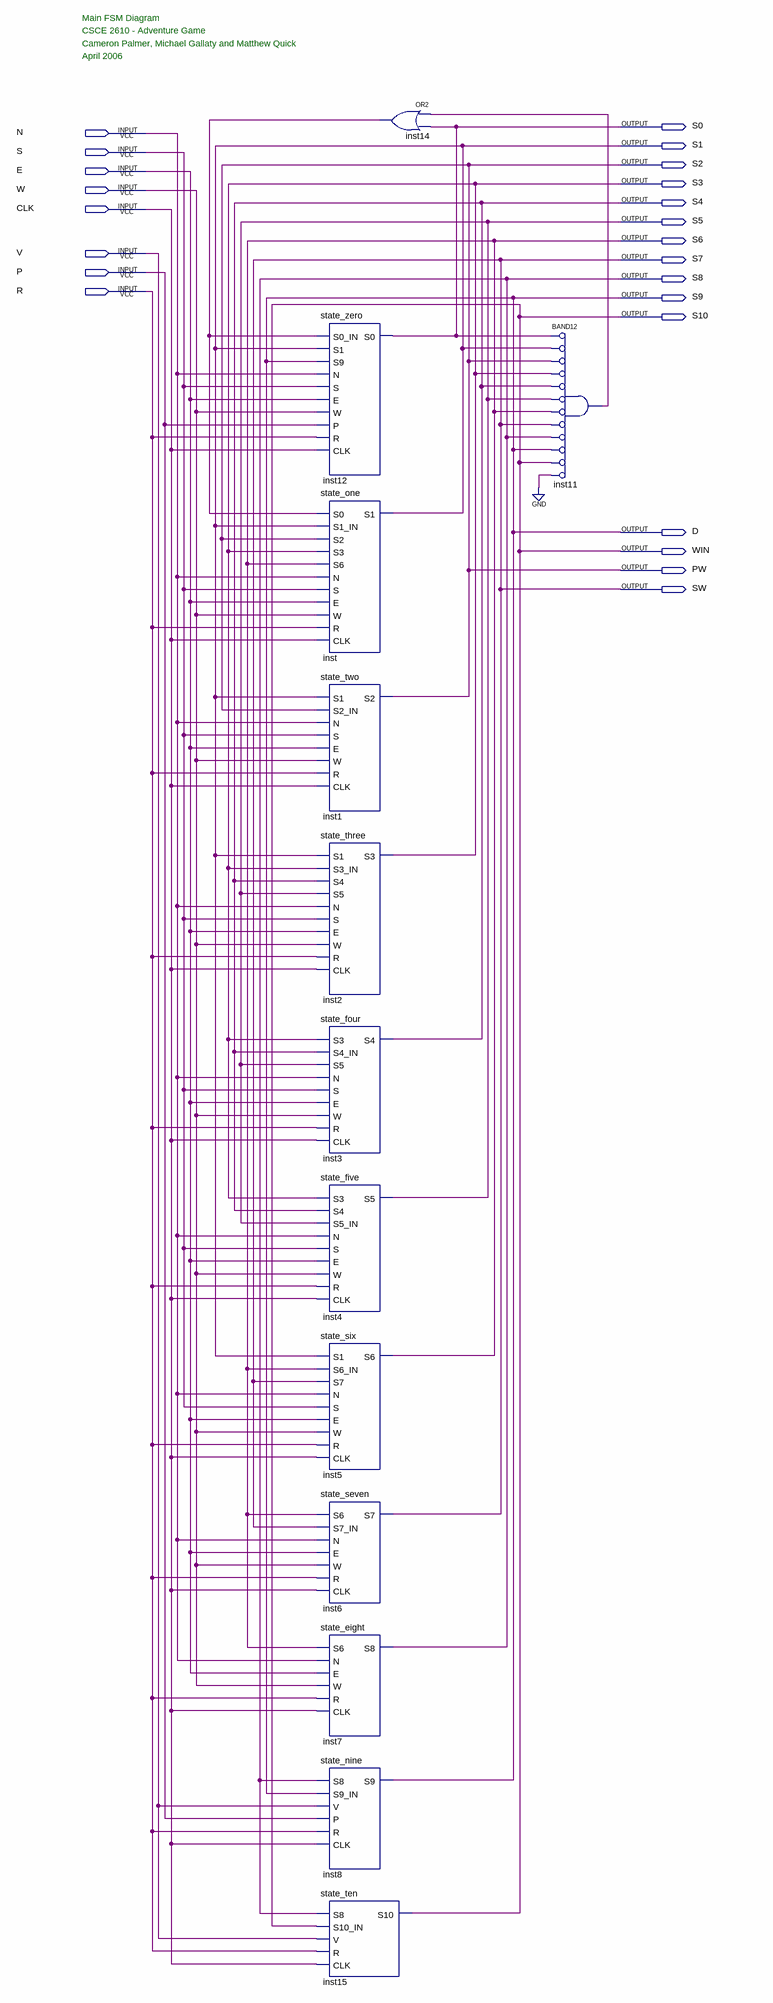
[diagram p0: schematic sheet]
// Quartus schematic main_fsm.bdf as structural Verilog: 13 symbols, 23 pins
module main_fsm (
  input  N,
  input  S,
  input  E,
  input  W,
  input  CLK,
  input  V,
  input  P,
  input  R,
  output S0,
  output S1,
  output S2,
  output S3,
  output S4,
  output S5,
  output S6,
  output S7,
  output S8,
  output S9,
  output S10,
  output D,
  output WIN,
  output PW,
  output SW
);

  wire inst11_out, inst14_out;

  state_zero inst12 (.S0_IN(inst14_out), .S1(S1), .S9(D), .N(N), .S(S), .E(E), .W(W), .P(P), .R(R), .CLK(CLK), .S0(S0));
  state_one inst (
    .S0(inst14_out), .S1_IN(S1), .S2(PW), .S3(S3), .S6(S6), .N(N), .S(S), .E(E), .W(W), .R(R), .CLK(CLK),
    .S1(S1));
  state_two inst1 (.S1(S1), .S2_IN(PW), .N(N), .S(S), .E(E), .W(W), .R(R), .CLK(CLK), .S2(PW));
  state_three inst2 (.S1(S1), .S3_IN(S3), .S4(S4), .S5(S5), .N(N), .S(S), .E(E), .W(W), .R(R), .CLK(CLK), .S3(S3));
  state_four inst3 (.S3(S3), .S4_IN(S4), .S5(S5), .N(N), .S(S), .E(E), .W(W), .R(R), .CLK(CLK), .S4(S4));
  state_five inst4 (.S3(S3), .S4(S4), .S5_IN(S5), .N(N), .S(S), .E(E), .W(W), .R(R), .CLK(CLK), .S5(S5));
  state_six inst5 (.S1(S1), .S6_IN(S6), .S7(S7), .N(N), .S(S), .E(E), .W(W), .R(R), .CLK(CLK), .S6(S6));
  state_seven inst6 (.S6(S6), .S7_IN(S7), .N(N), .E(E), .W(W), .R(R), .CLK(CLK), .S7(S7));
  state_eight inst7 (.S6(S6), .N(N), .E(E), .W(W), .R(R), .CLK(CLK), .S8(S8));
  state_nine inst8 (.S8(S8), .S9_IN(D), .V(V), .P(P), .R(R), .CLK(CLK), .S9(D));
  state_ten inst15 (.S8(S8), .S10_IN(S10), .V(V), .R(R), .CLK(CLK), .S10(S10));
  or inst14 (inst14_out, inst11_out, S0);
  and inst11 (inst11_out, ~S0, ~S1, ~PW, ~S3, ~S4, ~S5, ~S6, ~S7, ~S8, ~D, ~S10, ~1'b0);  // BAND12

  assign S2 = PW;
  assign S9 = D;
  assign SW = S7;
  assign WIN = S10;

  // Notes on the sheet:
  //   Main FSM Diagram
  //   CSCE 2610 - Adventure Game
  //   Cameron Palmer, Michael Gallaty and Matthew Quick
  //   April 2006
endmodule
